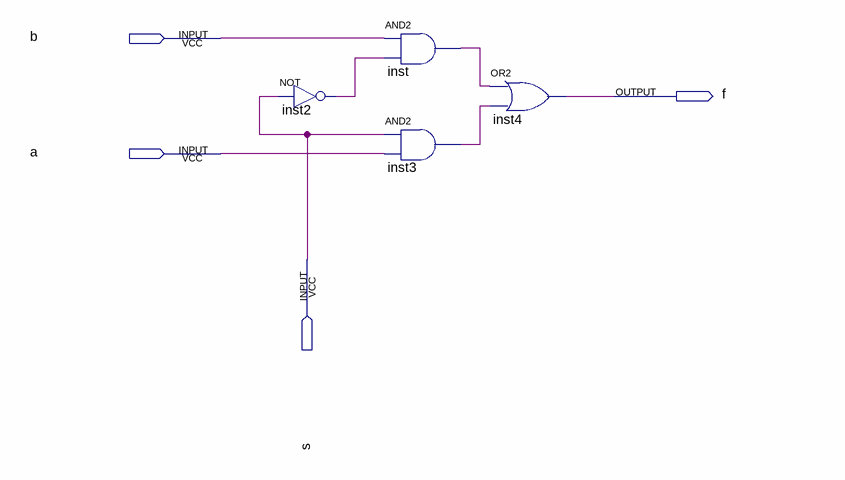
[diagram p0: schematic sheet]
// Quartus schematic Block2.bdf as structural Verilog: 4 symbols, 4 pins
module Block2 (
  input  b,
  input  a,
  input  s,
  output f
);

  wire inst2_out, inst3_out, inst_out;

  not inst2 (inst2_out, s);
  and inst (inst_out, b, inst2_out);
  and inst3 (inst3_out, s, a);
  or inst4 (f, inst_out, inst3_out);
endmodule
